# Altium schematic sheet Converter.SchDoc
size A; SheetNumber: 2; SheetTotal: 5
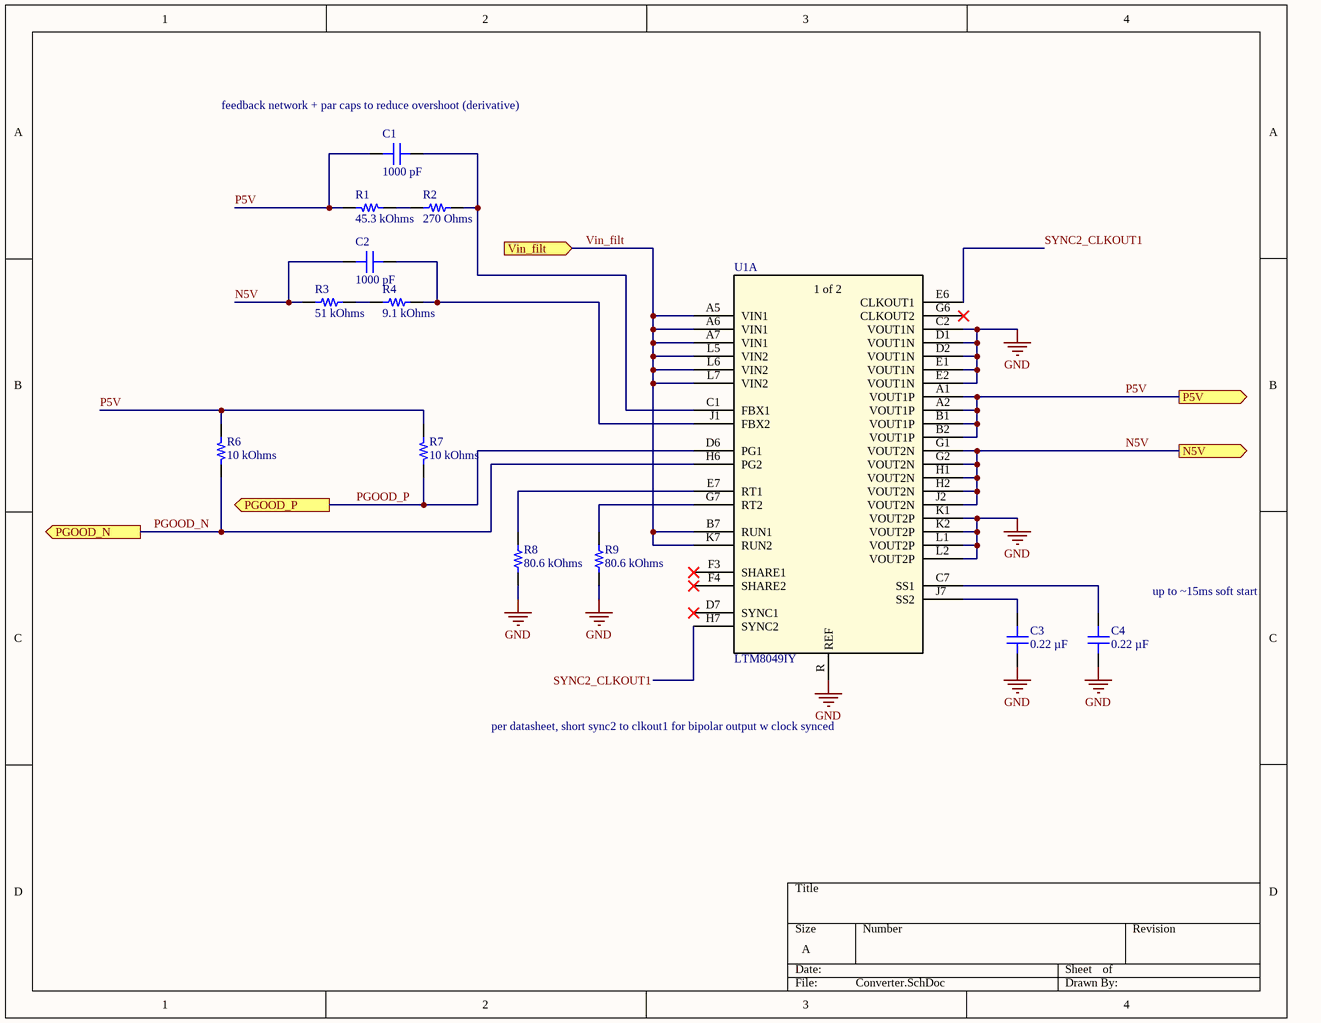
[diagram p0: Converter.SchDoc]

## Parts
C1  1000 pF  [CAP 0805_2012]
C2  1000 pF  [CAP 0805_2012]
C3  0.22 µF  [CAP 0805_2012]
C4  0.22 µF  [CAP 0805_2012]
R1  45.3 kOhms  [RES 1206_3216]
R2  270 Ohms  [RES 0805_2012]
R3  51 kOhms  [RES 0805_2012]
R4  9.1 kOhms  [RES 0805_2012]
R6  10 kOhms  [RES 0805_2012]
R7  10 kOhms  [RES 0805_2012]
R8  80.6 kOhms  [RES 1206_3216]
R9  80.6 kOhms  [RES 1206_3216]
U1  LTM8049IY  [LTM8049IY_ADI]  (part A of 2)

## Ports
N5V (out), P5V (out), PGOOD_N (out), PGOOD_P (out), Vin_filt (in)

## Nets
GND: C3.1 C4.1 R8.1 R9.1 U1.C2(VOUT1N) U1.D1(VOUT1N) U1.D2(VOUT1N) U1.E1(VOUT1N) U1.E2(VOUT1N) U1.K1(VOUT2P) U1.K2(VOUT2P) U1.L1(VOUT2P) U1.L2(VOUT2P) U1.R(REF)
N5V: C2.1 R3.1 U1.G1(VOUT2N) U1.G2(VOUT2N) U1.H1(VOUT2N) U1.H2(VOUT2N) U1.J2(VOUT2N) ; port N5V
P5V: C1.1 R1.1 R6.2 R7.2 U1.A1(VOUT1P) U1.A2(VOUT1P) U1.B1(VOUT1P) U1.B2(VOUT1P) ; port P5V
PGOOD_N: R6.1 U1.H6(PG2) ; port PGOOD_N
PGOOD_P: R7.1 U1.D6(PG1) ; port PGOOD_P
SYNC2_CLKOUT1: U1.E6(CLKOUT1) U1.H7(SYNC2)
Vin_filt: U1.A5(VIN1) U1.A6(VIN1) U1.A7(VIN1) U1.B7(RUN1) U1.K7(RUN2) U1.L5(VIN2) U1.L6(VIN2) U1.L7(VIN2) ; port Vin_filt
NetC1_2: C1.2 R2.2 U1.C1(FBX1)
NetC2_2: C2.2 R4.2 U1.J1(FBX2)
NetC3_2: C3.2 U1.J7(SS2)
NetC4_2: C4.2 U1.C7(SS1)
NetR1_2: R1.2 R2.1
NetR3_2: R3.2 R4.1
NetR8_2: R8.2 U1.E7(RT1)
NetR9_2: R9.2 U1.G7(RT2)

Not connected (* = marked no-connect by the designer): U1 D7(SYNC1)* F3(SHARE1)* F4(SHARE2)* G6(CLKOUT2)*

## Notes on the sheet
- (near C1) feedback network + par caps to reduce overshoot (derivative)
- up to ~15ms soft start
- per datasheet, short sync2 to clkout1 for bipolar output w clock synced
- (in symbol LTM8049IY, part A) 1 of 2

## Library data of the parts
C1 C2 = C0805C102J5RAC7800: CAP CER 1000PF 50V X7R 0805; Part Number: C0805C102J5RACTU; manufacturer: KEMET; Tolerance: ±5%; Value: 1000 pF; Applications: Bypass, Decoupling; Capacitance: 1000 pF; componentlink1description: Datasheet; componentlink1url: https://api.kemet.com/component-edge/download/datasheet/C0805C102J5RACTU.pdf; componentlink2description: DigiKey Link; componentlink2url: https://www.digikey.com/en/products/detail/kemet/C0805C102J5RAC7800/411148; Device Package: 0805 (2012 Metric); lastupdated: 7/15/2023 7:10:24 PM; Lifecycle Status: Active; Minimum Order: 1; Mounting Type: Surface Mount, MLCC; Operating Temperature: -55°C ~ 125°C; Package / Case: 0805 (2012 Metric); packaging: TapeAndReel; partid: 32561; Part Status: Active; price: 0.01; series: SMD Comm X7R; Size / Dimension: 0.079" L x 0.049" W (2.00mm x 1.25mm); Supplier 1: DigiKey; Supplier Part Number 1: 399-C0805C102J5RAC7800CT-ND; Temperature Coefficient: X7R; Thickness (Max): 0.035" (0.88mm); Voltage - Rated: 50V
C3 C4 = C0805C224K5RAC7800: CAP CER 0.22UF 50V X7R 0805; Part Number: C0805C224K5RACTU; manufacturer: KEMET; Tolerance: ±10%; Value: 0.22 µF; Applications: Bypass, Decoupling; Capacitance: 0.22 µF; componentlink1description: Datasheet; componentlink1url: https://api.kemet.com/component-edge/download/datasheet/C0805C224K5RACTU.pdf; componentlink2description: DigiKey Link; componentlink2url: https://www.digikey.com/en/products/detail/kemet/C0805C224K5RAC7800/754753; Device Package: 0805 (2012 Metric); lastupdated: 7/15/2023 7:10:33 PM; Lifecycle Status: Active; Minimum Order: 1; Mounting Type: Surface Mount, MLCC; Operating Temperature: -55°C ~ 125°C; Package / Case: 0805 (2012 Metric); packaging: TapeAndReel; partid: 33070; Part Status: Active; price: 0.02; series: SMD Comm X7R; Size / Dimension: 0.079" L x 0.049" W (2.00mm x 1.25mm); Supplier 1: DigiKey; Supplier Part Number 1: 399-C0805C224K5RACTUCT-ND; Temperature Coefficient: X7R; Thickness (Max): 0.055" (1.40mm); Voltage - Rated: 50V
R1 = ERA-8ARW4532V: RES SMD 45.3KOHM 0.05% 1/4W 1206; Manufacturer: Panasonic Electronic Components; Power (Watts): 0.25W, 1/4W; Temperature Coefficient: ±10ppm/°C; Part Number: ERA-8ARW4532V; ComponentLink1Description: Datasheet; ComponentLink1URL: https://industrial.panasonic.com/cdbs/www-data/pdf/RDM0000/AOA0000C307.pdf; ComponentLink2Description: DigiKey Link; ComponentLink2URL: https://www.digikey.com/en/products/detail/panasonic-electronic-components/ERA-8ARW4532V/5163072; Composition: Thin Film; Device Package: 1206 (3216 Metric); Features: Automotive AEC-Q200; Height - Seated (Max): 0.028" (0.70mm); LastUpdated: 7/13/2023 7:33:23 PM; Lifecycle Status: Active; Minimum Order: 1; Number of Terminations: 2; Operating Temperature: -55°C ~ 155°C; Package / Case: 1206 (3216 Metric); Packaging: TapeAndReel; PartId: 46049; Part Status: Active; Price: 0.56; Ratings: AEC-Q200; Resistance: 45.3 kOhms; Series: ERA-8A; Size / Dimension: 0.126" L x 0.063" W (3.20mm x 1.60mm); Supplier 1: DigiKey; Supplier Part Number 1: P18856CT-ND; Supplier Device Package: 1206; Tolerance: ±0.05%; Value: 45.3 kOhms
R2 = ERJ-PB6B2700V: RES SMD 270 OHM 0.1% 1/4W 0805; Manufacturer: Panasonic Electronic Components; Power (Watts): 0.25W, 1/4W; Temperature Coefficient: ±50ppm/°C; Part Number: ERJ-PB6B2700V; Value: 270 Ohms; ComponentLink1Description: Datasheet; ComponentLink1URL: https://industrial.panasonic.com/cdbs/www-data/pdf/RDM0000/AOA0000C328.pdf; ComponentLink2Description: DigiKey Link; ComponentLink2URL: https://www.digikey.com/en/products/detail/panasonic-electronic-components/ERJ-PB6B2700V/6213310; Composition: Thick Film; Device Package: 0805 (2012 Metric); Features: Automotive AEC-Q200, Pulse Withstanding; Height - Seated (Max): 0.028" (0.70mm); LastUpdated: 8/6/2023 8:08:39 PM; Lifecycle Status: Active; Minimum Order: 1; Number of Terminations: 2; Operating Temperature: -55°C ~ 155°C; Package / Case: 0805 (2012 Metric); Packaging: TapeAndReel; PartId: 31052; Part Status: Active; Price: 0.04; Ratings: AEC-Q200; Resistance: 270 Ohms; Series: ERJ-PB6; Size / Dimension: 0.079" L x 0.049" W (2.00mm x 1.25mm); Supplier 1: DigiKey; Supplier Part Number 1: P20527CT-ND; Supplier Device Package: 0805; Tolerance: ±0.1%
R3 = TNPW080551K0BEEA: RES 51K OHM 0.1% 1/8W 0805; Manufacturer: Vishay Dale; Power (Watts): 0.125W, 1/8W; Temperature Coefficient: ±25ppm/°C; Part Number: TNPW080551K0BEEA; Value: 51 kOhms; ComponentLink1Description: Datasheet; ComponentLink1URL: http://www.vishay.com/docs/28758/tnpw_e3.pdf; ComponentLink2Description: DigiKey Link; ComponentLink2URL: https://www.digikey.com/en/products/detail/vishay-dale/TNPW080551K0BEEA/1607476; Composition: Thin Film; Device Package: 0805 (2012 Metric); Features: Anti-Sulfur, Automotive AEC-Q200, Moisture Resistant; Height - Seated (Max): 0.022" (0.55mm); LastUpdated: 8/6/2023 8:07:38 PM; Lifecycle Status: Active; Minimum Order: 1; Number of Terminations: 2; Operating Temperature: -55°C ~ 155°C; Package / Case: 0805 (2012 Metric); Packaging: TapeAndReel; PartId: 45487; Part Status: Active; Price: 0.16; Ratings: AEC-Q200; Resistance: 51 kOhms; Series: TNPW e3; Size / Dimension: 0.079" L x 0.049" W (2.00mm x 1.25mm); Supplier 1: DigiKey; Supplier Part Number 1: 541-3220-1-ND; Supplier Device Package: 0805; Tolerance: ±0.1%
R4 = TNPW08059K10BEEA: RES 9.1K OHM 0.1% 1/8W 0805; Manufacturer: Vishay Dale; Power (Watts): 0.2W, 1/5W; Temperature Coefficient: ±25ppm/°C; Part Number: TNPW08059K10BEEA; Value: 9.1 kOhms; ComponentLink1Description: Datasheet; ComponentLink1URL: http://www.vishay.com/docs/28758/tnpw_e3.pdf; ComponentLink2Description: DigiKey Link; ComponentLink2URL: http://digikey.com/product-detail/en/vishay-dale/TNPW08059K10BEEA/541-9869-1-ND/9659137; Composition: Thin Film; Device Package: 0805 (2012 Metric); Features: Anti-Sulfur, Automotive AEC-Q200, Moisture Resistant; Height - Seated (Max): 0.022" (0.55mm); LastUpdated: 8/6/2023 8:07:38 PM; Lifecycle Status: Active; Minimum Order: 1; Number of Terminations: 2; Operating Temperature: -55°C ~ 155°C; Package / Case: 0805 (2012 Metric); Packaging: TapeAndReel; PartId: 45465; Part Status: Active; Price: 0.18; Ratings: AEC-Q200; Resistance: 9.1 kOhms; Series: TNPW e3; Size / Dimension: 0.079" L x 0.049" W (2.00mm x 1.25mm); Supplier 1: DigiKey; Supplier Part Number 1: 541-9869-1-ND; Supplier Device Package: 0805; Tolerance: ±0.1%
R6 R7 = RT0805FRE1310KL: RES 10K OHM 1% 1/8W 0805; Manufacturer: Yageo; Power (Watts): 0.125W, 1/8W; Temperature Coefficient: ±50ppm/°C; Part Number: RT0805FRE1310KL; Value: 10 kOhms; ComponentLink1Description: Datasheet; ComponentLink1URL: https://www.yageo.com/upload/media/product/productsearch/datasheet/rchip/PYu-RT_1-to-0.01_RoHS_L_13.pdf; ComponentLink2Description: DigiKey Link; ComponentLink2URL: https://www.digikey.com/en/products/detail/yageo/RT0805FRE1310KL/16982152; Composition: Thin Film; Device Package: 0805 (2012 Metric); Features: Moisture Resistant; Height - Seated (Max): 0.024" (0.60mm); LastUpdated: 7/12/2023 7:50:22 PM; Lifecycle Status: Active; Minimum Order: 1; Number of Terminations: 2; Operating Temperature: -55°C ~ 155°C; Package / Case: 0805 (2012 Metric); Packaging: TapeAndReel; PartId: 76856; Part Status: Active; Price: 0.01; Resistance: 10 kOhms; Series: RT; Size / Dimension: 0.079" L x 0.049" W (2.00mm x 1.25mm); Supplier 1: DigiKey; Supplier Part Number 1: 13-RT0805FRE1310KLCT-ND; Supplier Device Package: 0805; Tolerance: ±1%
R8 R9 = ERA-8AEB8062V: RES SMD 80.6K OHM 0.1% 1/4W 1206; Manufacturer: Panasonic Electronic Components; Power (Watts): 0.25W, 1/4W; Temperature Coefficient: ±25ppm/°C; Part Number: ERA-8AEB8062V; ComponentLink1Description: Datasheet; ComponentLink1URL: https://industrial.panasonic.com/cdbs/www-data/pdf/RDM0000/AOA0000C307.pdf; ComponentLink2Description: DigiKey Link; ComponentLink2URL: https://www.digikey.com/en/products/detail/panasonic-electronic-components/ERA-8AEB8062V/3071179; Composition: Thin Film; Device Package: 1206 (3216 Metric); Features: Automotive AEC-Q200; Height - Seated (Max): 0.028" (0.70mm); LastUpdated: 8/5/2023 7:52:37 PM; Lifecycle Status: Active; Minimum Order: 1; Number of Terminations: 2; Operating Temperature: -55°C ~ 155°C; Package / Case: 1206 (3216 Metric); Packaging: TapeAndReel; PartId: 42629; Part Status: Active; Price: 0.10; Ratings: AEC-Q200; Resistance: 80.6 kOhms; Series: ERA-8A; Size / Dimension: 0.126" L x 0.063" W (3.20mm x 1.60mm); Supplier 1: DigiKey; Supplier Part Number 1: P80.6KBCCT-ND; Supplier Device Package: 1206; Tolerance: ±0.1%; Value: 80.6 kOhms
U1 = LTM8049IY: No Description Available; Manufacturer: Analog Devices Inc; RefDes: RefDes; Type: Type; Part Number: LTM8049IY